# Altium schematic sheet 21-M2_GNSS.SchDoc
size B; SheetNumber: 21; SheetTotal: 22
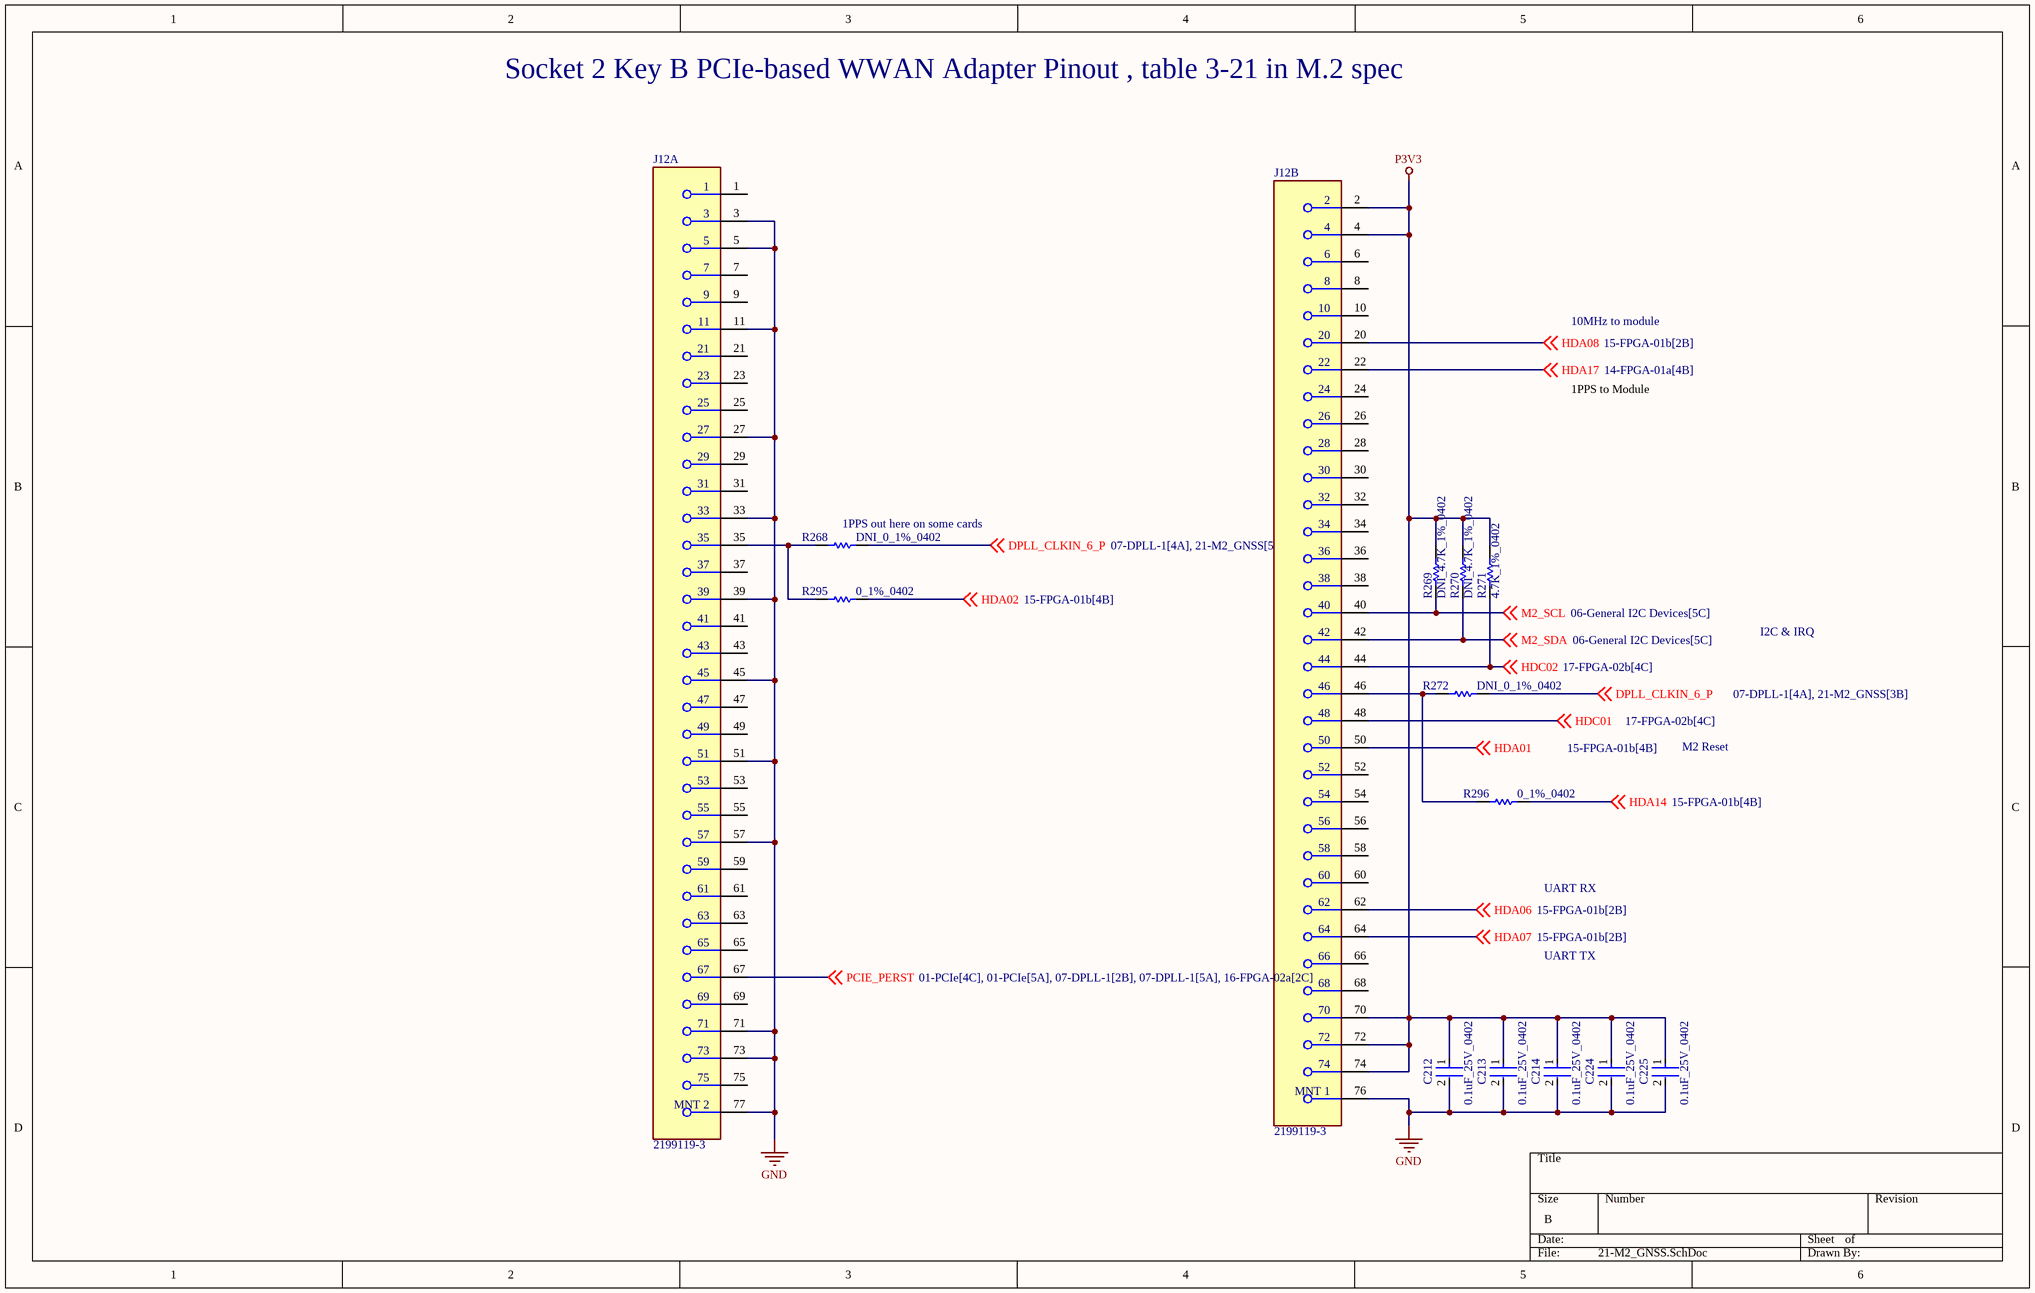
[diagram p0: 21-M2_GNSS.SchDoc]

## Parts
C212  0.1uF_25V_0402  [FP-0402-L_1_0_1-W_0_5_0_1-IPC_C]
C213  0.1uF_25V_0402  [FP-0402-L_1_0_1-W_0_5_0_1-IPC_C]
C214  0.1uF_25V_0402  [FP-0402-L_1_0_1-W_0_5_0_1-IPC_C]
C224  0.1uF_25V_0402  [FP-0402-L_1_0_1-W_0_5_0_1-IPC_C]
C225  0.1uF_25V_0402  [FP-0402-L_1_0_1-W_0_5_0_1-IPC_C]
J12  2199119-3  [FP-2199119-3-MFG]  (parts A,B of 2)
R268  DNI_0_1%_0402  [RESC1005X40X25LL05T05]  (no BOM)
R269  DNI_4.7K_1%_0402  [RESC1005X40X25NL10T10]  (no BOM)
R270  DNI_4.7K_1%_0402  [RESC1005X40X25NL10T10]  (no BOM)
R271  4.7K_1%_0402  [RESC1005X40X25NL10T10]
R272  DNI_0_1%_0402  [RESC1005X40X25LL05T05]  (no BOM)
R295  0_1%_0402  [RESC1005X40X25LL05T05]
R296  0_1%_0402  [RESC1005X40X25LL05T05]

## Nets
GND: C212.2 C213.2 C214.2 C224.2 C225.2 J12.3 J12.5 J12.11 J12.27 J12.33 J12.39 J12.45 J12.51 J12.57 J12.71 J12.73 J12.76(MNT_1) J12.77(MNT_2)
P3V3: C212.1 C213.1 C214.1 C224.1 C225.1 J12.2 J12.4 J12.70 J12.72 J12.74 R269.2 R270.2 R271.2
DPLL_CLKIN_6_P: R268.2 R272.2 ; off-sheet DPLL_CLKIN_6_P
HDA01: J12.50 ; off-sheet HDA01
HDA02: R295.2 ; off-sheet HDA02
HDA06: J12.62 ; off-sheet HDA06
HDA07: J12.64 ; off-sheet HDA07
HDA08: J12.20 ; off-sheet HDA08
HDA14: R296.2 ; off-sheet HDA14
HDA17: J12.22 ; off-sheet HDA17
HDC01: J12.48 ; off-sheet HDC01
HDC02: J12.44 R271.1 ; off-sheet HDC02
M2_SCL: J12.40 R269.1 ; off-sheet M2_SCL
M2_SDA: J12.42 R270.1 ; off-sheet M2_SDA
PCIE_PERST: J12.67 ; off-sheet PCIE_PERST
NetJ12_35: J12.35 R268.1 R295.1
NetJ12_46: J12.46 R272.1 R296.1

Not connected (* = marked no-connect by the designer): J12 1 6 7 8 9 10 21 23 24 25 26 28 29 30 31 32 34 36 37 38 41 43 47 49 52 53 54 55 56 58 59 60 61 63 65 66 68 69 75

## Notes on the sheet
- Socket 2 Key B PCIe-based WWAN Adapter Pinout , table 3-21 in M.2 spec
- 10MHz to module
- 1PPS to Module
- (near R268) 1PPS out here on some cards
- I2C & IRQ
- M2 Reset
- UART RX
- UART TX

## Library data of the parts
C212-C214 C224 C225 = CMP-2008-02519-2: General Purpose Ceramic Capacitor, 0402, 100nF, 10%, X7R, 15%, 25V; Package Quantity: 1; Capacitance: 100nF; Min Operating Temperature: -55°C; Voltage: 25V; Voltage Rating: 25V; Construction: Flat; Max Operating Temperature: 125°C; Radiation Hardening: No; Depth: 0.5mm; Thickness: 0.022inch; Voltage Rating (DC): 25V; Number of Pins: 2; Lead Free: Lead Free; Series: -; REACH SVHC: No SVHC; Length: 1mm; Dielectric: X7R; RoHS Compliant: Yes; Mount: Surface Mount; Packaging: Tape and Reel; Case/Package: 0402; Case Code (Imperial): 0402; Termination: SMD/SMT; Width: 0.02inch; Case Code (Metric): 1005; Tolerance: 10%
J12 = CMP-03365-000004-1: CONN M.2 FEMALE 67POS 0.020 GOLD; Contact Current Rating: 500mA; Number of Contacts: 67; PCB Mounting Orientation: Right Angle; Pitch: 0.5mm; Voltage Rating: 50V; Insulation Resistance: 500MR; Row Spacing: 7.55mm; Orientation: Right Angle; Length: 0.862inch; Radiation Hardening: No; Mount: Surface Mount; Contact Plating: Gold; Contact Material: Copper Alloy; Width: 8.7mm; Number of Rows: 2; Color: Black; ELV: Compliant; Housing Color: Black; Number of Positions: 67; Housing Material: Thermoplastic; Gender: Female; Min Operating Temperature: -40°C; Max Operating Temperature: 80°C; RoHS Compliant: Yes; Package Quantity: 1200; Packaging: Tape and Reel; Height: 3.2mm; Termination: Solder; Insulation Material: Thermoplastic; Max Voltage Rating (AC): 50V; Current Rating: 500mA
R268 R272 R295 R296 = CMP-2000-07451-1: Chip Resistor, 0 Ohm, 0.1 W, -55 to 155 degC, 0402 (1005 Metric), RoHS, Tape and Reel; Manufacturer: Panasonic; Voltage Rating (DC): 50V; Temperature Coefficient: 600ppm/��C; Max Power Dissipation: 100mW; Resistance: 0mOhm; Tolerance: 5%; Number of Terminations: 2; Mount: SurfaceMount; Height: 0.35mm; Packaging: TapeandReel; Contact Plating: Tin; Manufacturer URL: http://www.panasonic.com/; Composition: ThickFilm; Max Operating Temperature: 155degC; REACH SVHC: NoSVHC; Case/Package: 0402; Package Reference: 402; Depth: 0.5mm; Package Description: 2-Pin Surface Mount Device, Body 1 x 0.5 mm; Datasheet URL: https://industrial.panasonic.com/cdbs/www-data/pdf/RDA0000/AOA0000C301.pdf; RoHSCompliant: True; Case Code (Imperial): 0402; Military Standard: Not; Min Operating Temperature: -55degC; Power Rating: 100mW; Datasheet Version: 03/2015; Length: 1mm; Case Code (Metric): 1005; Termination: SMD/SMT; Mounting Technology: SurfaceMount; Voltage Rating: 50V; Width: 0.02inch; Package Quantity: 1; Lead Free: LeadFree; Radiation Hardening: No
R269-R271 = CMP-2002-05217-1: Manufacturer: Bourns; Part Number: CR0402-FX-4701GLF